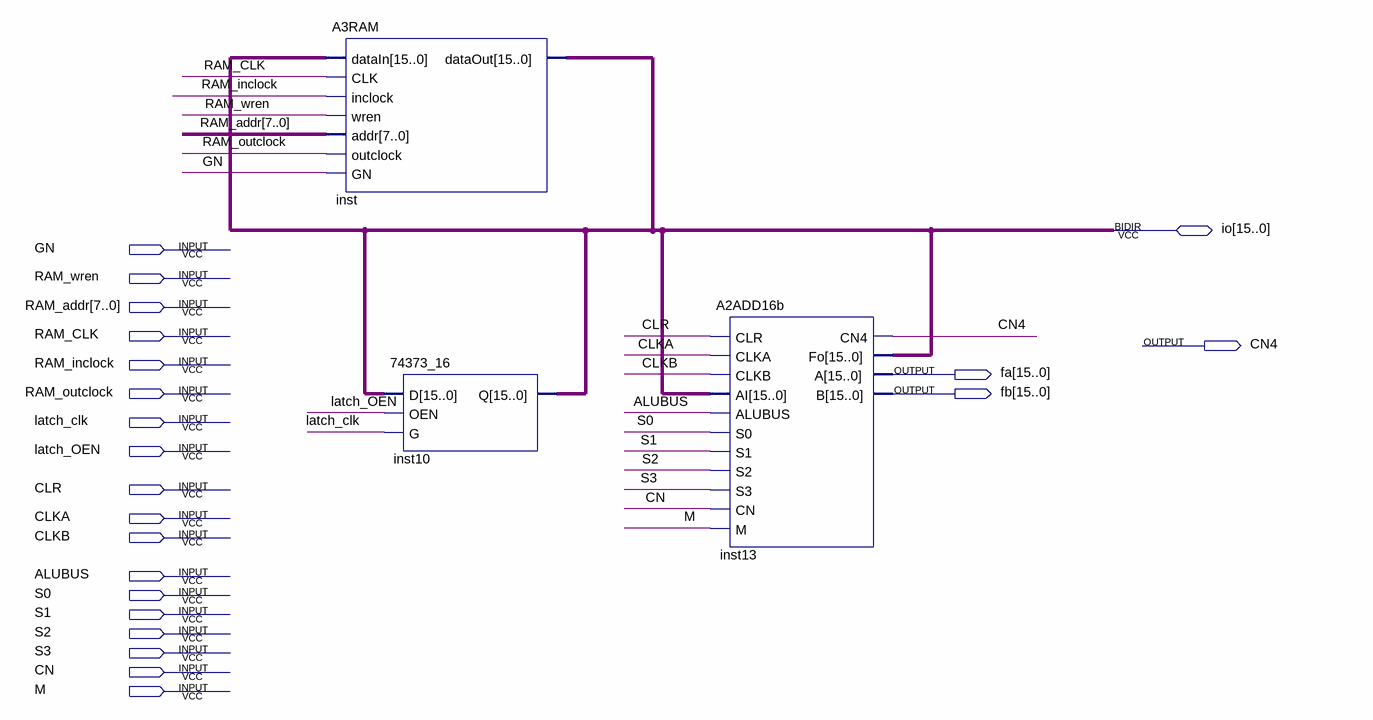
[diagram p0: schematic sheet]
// Quartus schematic A3.bdf as structural Verilog: 3 symbols, 22 pins
module A3 (
  input  GN,
  input  RAM_wren,
  input  [7:0] RAM_addr,
  input  RAM_CLK,
  input  RAM_inclock,
  input  RAM_outclock,
  input  latch_clk,
  input  latch_OEN,
  input  CLR,
  input  CLKA,
  input  CLKB,
  input  ALUBUS,
  input  S0,
  input  S1,
  input  S2,
  input  S3,
  input  CN,
  input  M,
  inout  [15:0] io,
  output CN4,
  output [15:0] fa,
  output [15:0] fb
);

  A3RAM inst (
    .dataIn(io), .CLK(RAM_CLK), .inclock(RAM_inclock), .wren(RAM_wren), .addr(RAM_addr),
    .outclock(RAM_outclock), .GN(GN), .dataOut(io));
  \74373_16  inst10 (.D(io), .OEN(latch_OEN), .G(latch_clk), .Q(io));
  A2ADD16b inst13 (
    .CLR(CLR), .CLKA(CLKA), .CLKB(CLKB), .AI(io), .ALUBUS(ALUBUS), .S0(S0), .S1(S1), .S2(S2), .S3(S3),
    .CN(CN), .M(M), .CN4(CN4), .Fo(io), .A(fa), .B(fb));
endmodule
